# EAGLE design box_opener (EAGLE 9.3.2)
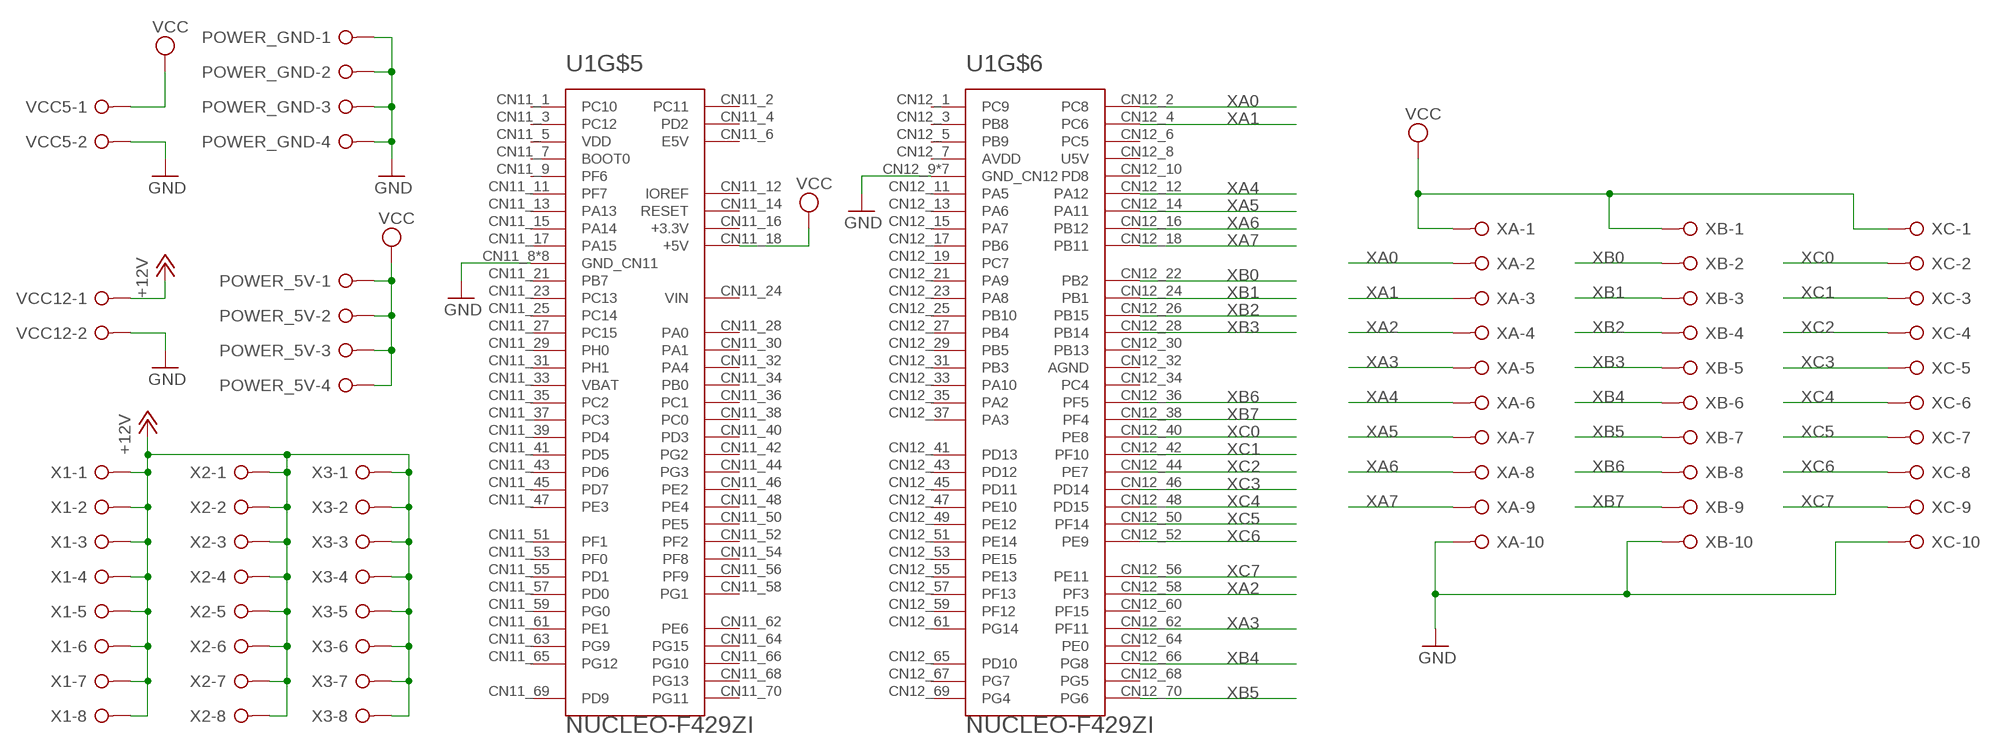
[diagram p0: schematic, sheet 1]

## Parts
POWER_5V  W237-04P  [W237-4P]
POWER_GND  W237-04P  [W237-4P]
U1  NUCLEO-F429ZI  [MODULE_NUCLEO-F429ZI]
VCC5  W237-02P  [W237-132]
VCC12  W237-02P  [W237-132]
X1  W237-08P  [W237-8P]
X2  W237-08P  [W237-8P]
X3  W237-08P  [W237-8P]
XA  W237-10P  [W237-10P]
XB  W237-10P  [W237-10P]
XC  W237-10P  [W237-10P]

## Nets
+12V: VCC12.1 X1.1 X1.2 X1.3 X1.4 X1.5 X1.6 X1.7 X1.8 X2.1 X2.2 X2.3 X2.4 X2.5 X2.6 X2.7 X2.8 X3.1 X3.2 X3.3 X3.4 X3.5 X3.6 X3.7 X3.8
GND: POWER_GND.1 POWER_GND.2 POWER_GND.3 POWER_GND.4 U1.CN11_8(GND_CN11) U1.CN11_19(GND_CN11) U1.CN11_20(GND_CN11) U1.CN11_22(GND_CN11) U1.CN11_49(GND_CN11) U1.CN11_60(GND_CN11) U1.CN11_71(GND_CN11) U1.CN11_72(GND_CN11) U1.CN12_9(GND_CN12) U1.CN12_20(GND_CN12) U1.CN12_39(GND_CN12) U1.CN12_54(GND_CN12) U1.CN12_63(GND_CN12) U1.CN12_71(GND_CN12) U1.CN12_72(GND_CN12) VCC5.2 VCC12.2 XA.10 XB.10 XC.10
VCC: POWER_5V.1 POWER_5V.2 POWER_5V.3 POWER_5V.4 U1.CN11_18(+5V) VCC5.1 XA.1 XB.1 XC.1
XA0: U1.CN12_2(PC8) XA.2
XA1: U1.CN12_4(PC6) XA.3
XA2: U1.CN12_58(PF3) XA.4
XA3: U1.CN12_62(PF11) XA.5
XA4: U1.CN12_12(PA12) XA.6
XA5: U1.CN12_14(PA11) XA.7
XA6: U1.CN12_16(PB12) XA.8
XA7: U1.CN12_18(PB11) XA.9
XB0: U1.CN12_22(PB2) XB.2
XB1: U1.CN12_24(PB1) XB.3
XB2: U1.CN12_26(PB15) XB.4
XB3: U1.CN12_28(PB14) XB.5
XB4: U1.CN12_66(PG8) XB.6
XB5: U1.CN12_70(PG6) XB.7
XB6: U1.CN12_36(PF5) XB.8
XB7: U1.CN12_38(PF4) XB.9
XC0: U1.CN12_40(PE8) XC.2
XC1: U1.CN12_42(PF10) XC.3
XC2: U1.CN12_44(PE7) XC.4
XC3: U1.CN12_46(PD14) XC.5
XC4: U1.CN12_48(PD15) XC.6
XC5: U1.CN12_50(PF14) XC.7
XC6: U1.CN12_52(PE9) XC.8
XC7: U1.CN12_56(PE11) XC.9
Unconnected: U1.CN7_1(D16/PC6/I2S_A_MCK) U1.CN7_2(D15/PB8/I2C_A_SCL) U1.CN7_3(D17/PB15/I2S_A_SD) U1.CN7_4(D14/PB9/I2C_A_SDA) U1.CN7_5(D18/PB13/I2S_A_CK) U1.CN7_6(AVDD) U1.CN7_7(D19/PB12/I2S_A_WS) U1.CN7_8(GND_CN7) U1.CN7_9(D20/PA15/I2S_B_WS) U1.CN7_10(D13/PA5/SPI_A_SCK) U1.CN7_11(D21/PC7/I2S_B_MCK) U1.CN7_12(D12/PA6/SPI_A_MISO) U1.CN7_13(D22/PB5/I2S_B_SD/SPI_B_MOSI) U1.CN7_14(D11/ETH/PA7/SPI_A_MOSI/TIM_E_PWM1) U1.CN7_15(D23/PB3/I2S_B_CK/SPI_B_SCK) U1.CN7_16(D10/PD14/SPI_A_CS/TIM_B_PWM3) U1.CN7_17(D24/PA4/SPI_B_NSS) U1.CN7_18(D9/PD15/TIMER_B_PWM2) U1.CN7_19(D25/PB4/SPI_B_MISO) U1.CN7_20(D8/PF12) U1.CN8_2(D43/PC8/SDMMC_D0) U1.CN8_3(IOREF) U1.CN8_4(D44/PC9/SDMMC_D1/I2S_A_CKIN) U1.CN8_5(RESET) U1.CN8_6(D45/PC10/SDMMC_D2) U1.CN8_7(+3.3V) U1.CN8_8(D46/PC11/SDMMC_D3) U1.CN8_9(+5V) U1.CN8_10(D47/PC12/SDMMC_CK) U1.CN8_11(GND_CN8) U1.CN8_12(D48/PD2/SDMMC_CMD) U1.CN8_13(GND_CN8) U1.CN8_14(D49/PG2) U1.CN8_15(VIN) U1.CN8_16(D50/PG3) U1.CN9_1(A0/PA3) U1.CN9_2(D51/PD7/USART_B_SCLK) U1.CN9_3(A1/PC0) U1.CN9_4(D52/PD6/USART_B_RX) U1.CN9_5(A2/PC3) U1.CN9_6(D53/PD5/USART_B_TX) U1.CN9_7(A3/PF3) U1.CN9_8(D54/PD4/USART_B_RTS) U1.CN9_9(A4/PF5) U1.CN9_10(D55/PD3/USART_B_CTS) U1.CN9_11(A5/PF10) U1.CN9_12(GND_CN9) U1.CN9_13(D72/NC) U1.CN9_14(D56/PE2/SAI_A_MCLK) U1.CN9_15(D71/PA7) U1.CN9_16(D57/PE4/SAI_A_FS) U1.CN9_17(D70/PF2/I2C_B_SMBA) U1.CN9_18(D58/PE5/SAI_A_SCK) U1.CN9_19(D69/PF1/I2C_B_SCL) U1.CN9_20(D59/PE6/SAI_A_SD) U1.CN9_21(D68/PF0/I2C_B_SDA) U1.CN9_22(D60/PE3/SAI_B_SD) U1.CN9_23(GND_CN9) U1.CN9_24(D61/PF8/SAI_B_SCK) U1.CN9_25(D67/PD0/CAN_RX) U1.CN9_26(D62/PF7/SAI_B_MCLK) U1.CN9_27(D66/PD1/CAN_TX) U1.CN9_28(D63/PF9/SAI_B_FS) U1.CN9_29(D65/PG0) U1.CN9_30(D64/PG1) U1.CN10_1(AVDD) U1.CN10_2(D7/PF13) U1.CN10_3(AGND) U1.CN10_4(D6/PE9/TIMER_A_PWM1) U1.CN10_5(GND_CN10) U1.CN10_6(D5/PE11/TIMER_A_PWM2) U1.CN10_7(A6/PB1/ADC_A_IN) U1.CN10_8(D4/PF14) U1.CN10_9(A7/PC2/ADC_B_IN) U1.CN10_10(D3/PE13/TIMER_A_PWM3) U1.CN10_11(A8/PF4/ADC_C_IN) U1.CN10_12(D2/PF15) U1.CN10_13(D26/PB6) U1.CN10_14(D1/PG14/USART_A_TX) U1.CN10_15(D27/PB2) U1.CN10_16(D0/PG9/USART_A_RX) U1.CN10_17(GND_CN10) U1.CN10_18(D42/PE8/TIMER_A_PWM1N) U1.CN10_19(D28/PD13) U1.CN10_20(D41/PE7/TIMER_A_ETR) U1.CN10_21(D29/PD12) U1.CN10_22(GND_CN10) U1.CN10_23(D30/PD11) U1.CN10_24(D40/PE10/TIMER_A_PWM2N) U1.CN10_25(D31/PE2) U1.CN10_26(D39/PE12/TIMER_A_PWM3N) U1.CN10_27(GND_CN10) U1.CN10_28(D38/PE14) U1.CN10_29(D32/PA0/TIMER_C_PWM1) U1.CN10_30(D37/PE15/TIMER_A_BKIN1) U1.CN10_31(D33/PB0/TIMER_D_PWM1) U1.CN10_32(D36/PB10/TIMER_C_PWM2) U1.CN10_33(D34/PE0/TIMER_B_ETR) U1.CN10_34(D35/PB11/TIMER_C_PWM3) U1.CN11_1(PC10) U1.CN11_2(PC11) U1.CN11_3(PC12) U1.CN11_4(PD2) U1.CN11_5(VDD) U1.CN11_6(E5V) U1.CN11_7(BOOT0) U1.CN11_9(PF6) U1.CN11_11(PF7) U1.CN11_12(IOREF) U1.CN11_13(PA13) U1.CN11_14(RESET) U1.CN11_15(PA14) U1.CN11_16(+3.3V) U1.CN11_17(PA15) U1.CN11_21(PB7) U1.CN11_23(PC13) U1.CN11_24(VIN) U1.CN11_25(PC14) U1.CN11_27(PC15) U1.CN11_28(PA0) U1.CN11_29(PH0) U1.CN11_30(PA1) U1.CN11_31(PH1) U1.CN11_32(PA4) U1.CN11_33(VBAT) U1.CN11_34(PB0) U1.CN11_35(PC2) U1.CN11_36(PC1) U1.CN11_37(PC3) U1.CN11_38(PC0) U1.CN11_39(PD4) U1.CN11_40(PD3) U1.CN11_41(PD5) U1.CN11_42(PG2) U1.CN11_43(PD6) U1.CN11_44(PG3) U1.CN11_45(PD7) U1.CN11_46(PE2) U1.CN11_47(PE3) U1.CN11_48(PE4) U1.CN11_50(PE5) U1.CN11_51(PF1) U1.CN11_52(PF2) U1.CN11_53(PF0) U1.CN11_54(PF8) U1.CN11_55(PD1) U1.CN11_56(PF9) U1.CN11_57(PD0) U1.CN11_58(PG1) U1.CN11_59(PG0) U1.CN11_61(PE1) U1.CN11_62(PE6) U1.CN11_63(PG9) U1.CN11_64(PG15) U1.CN11_65(PG12) U1.CN11_66(PG10) U1.CN11_68(PG13) U1.CN11_69(PD9) U1.CN11_70(PG11) U1.CN12_1(PC9) U1.CN12_3(PB8) U1.CN12_5(PB9) U1.CN12_6(PC5) U1.CN12_7(AVDD) U1.CN12_8(U5V) U1.CN12_10(PD8) U1.CN12_11(PA5) U1.CN12_13(PA6) U1.CN12_15(PA7) U1.CN12_17(PB6) U1.CN12_19(PC7) U1.CN12_21(PA9) U1.CN12_23(PA8) U1.CN12_25(PB10) U1.CN12_27(PB4) U1.CN12_29(PB5) U1.CN12_30(PB13) U1.CN12_31(PB3) U1.CN12_32(AGND) U1.CN12_33(PA10) U1.CN12_34(PC4) U1.CN12_35(PA2) U1.CN12_37(PA3) U1.CN12_41(PD13) U1.CN12_43(PD12) U1.CN12_45(PD11) U1.CN12_47(PE10) U1.CN12_49(PE12) U1.CN12_51(PE14) U1.CN12_53(PE15) U1.CN12_55(PE13) U1.CN12_57(PF13) U1.CN12_59(PF12) U1.CN12_60(PF15) U1.CN12_61(PG14) U1.CN12_64(PE0) U1.CN12_65(PD10) U1.CN12_67(PG7) U1.CN12_68(PG5) U1.CN12_69(PG4)

## Library data of the parts
POWER_5V POWER_GND = con-wago-508:W237-04P: WAGO SREW CLAMP; OC_FARNELL: unknown; OC_NEWARK: unknown
U1 = NUCLEO-F429ZI:NUCLEO-F429ZI: STM32 Nucleo-144 development board with STM32F429ZIT6 MCU, supports Arduino, ST Zio and Morpho; AVAILABILITY: Unavailable; DESCRIPTION: STM32 Nucleo-144 development board with STM32F429ZIT6 MCU, supports Arduino, ST Zio and Morpho; MF: STMicroelectronics; MP: NUCLEO-F429ZI; PACKAGE: None; PRICE: None
VCC5 VCC12 = con-wago-508:W237-02P: WAGO SREW CLAMP; OC_FARNELL: unknown; OC_NEWARK: unknown
X1-X3 = con-wago-508:W237-08P: WAGO SREW CLAMP; OC_FARNELL: unknown; OC_NEWARK: unknown
XA XB XC = con-wago-508:W237-10P: WAGO SREW CLAMP; OC_FARNELL: unknown; OC_NEWARK: unknown

## Board
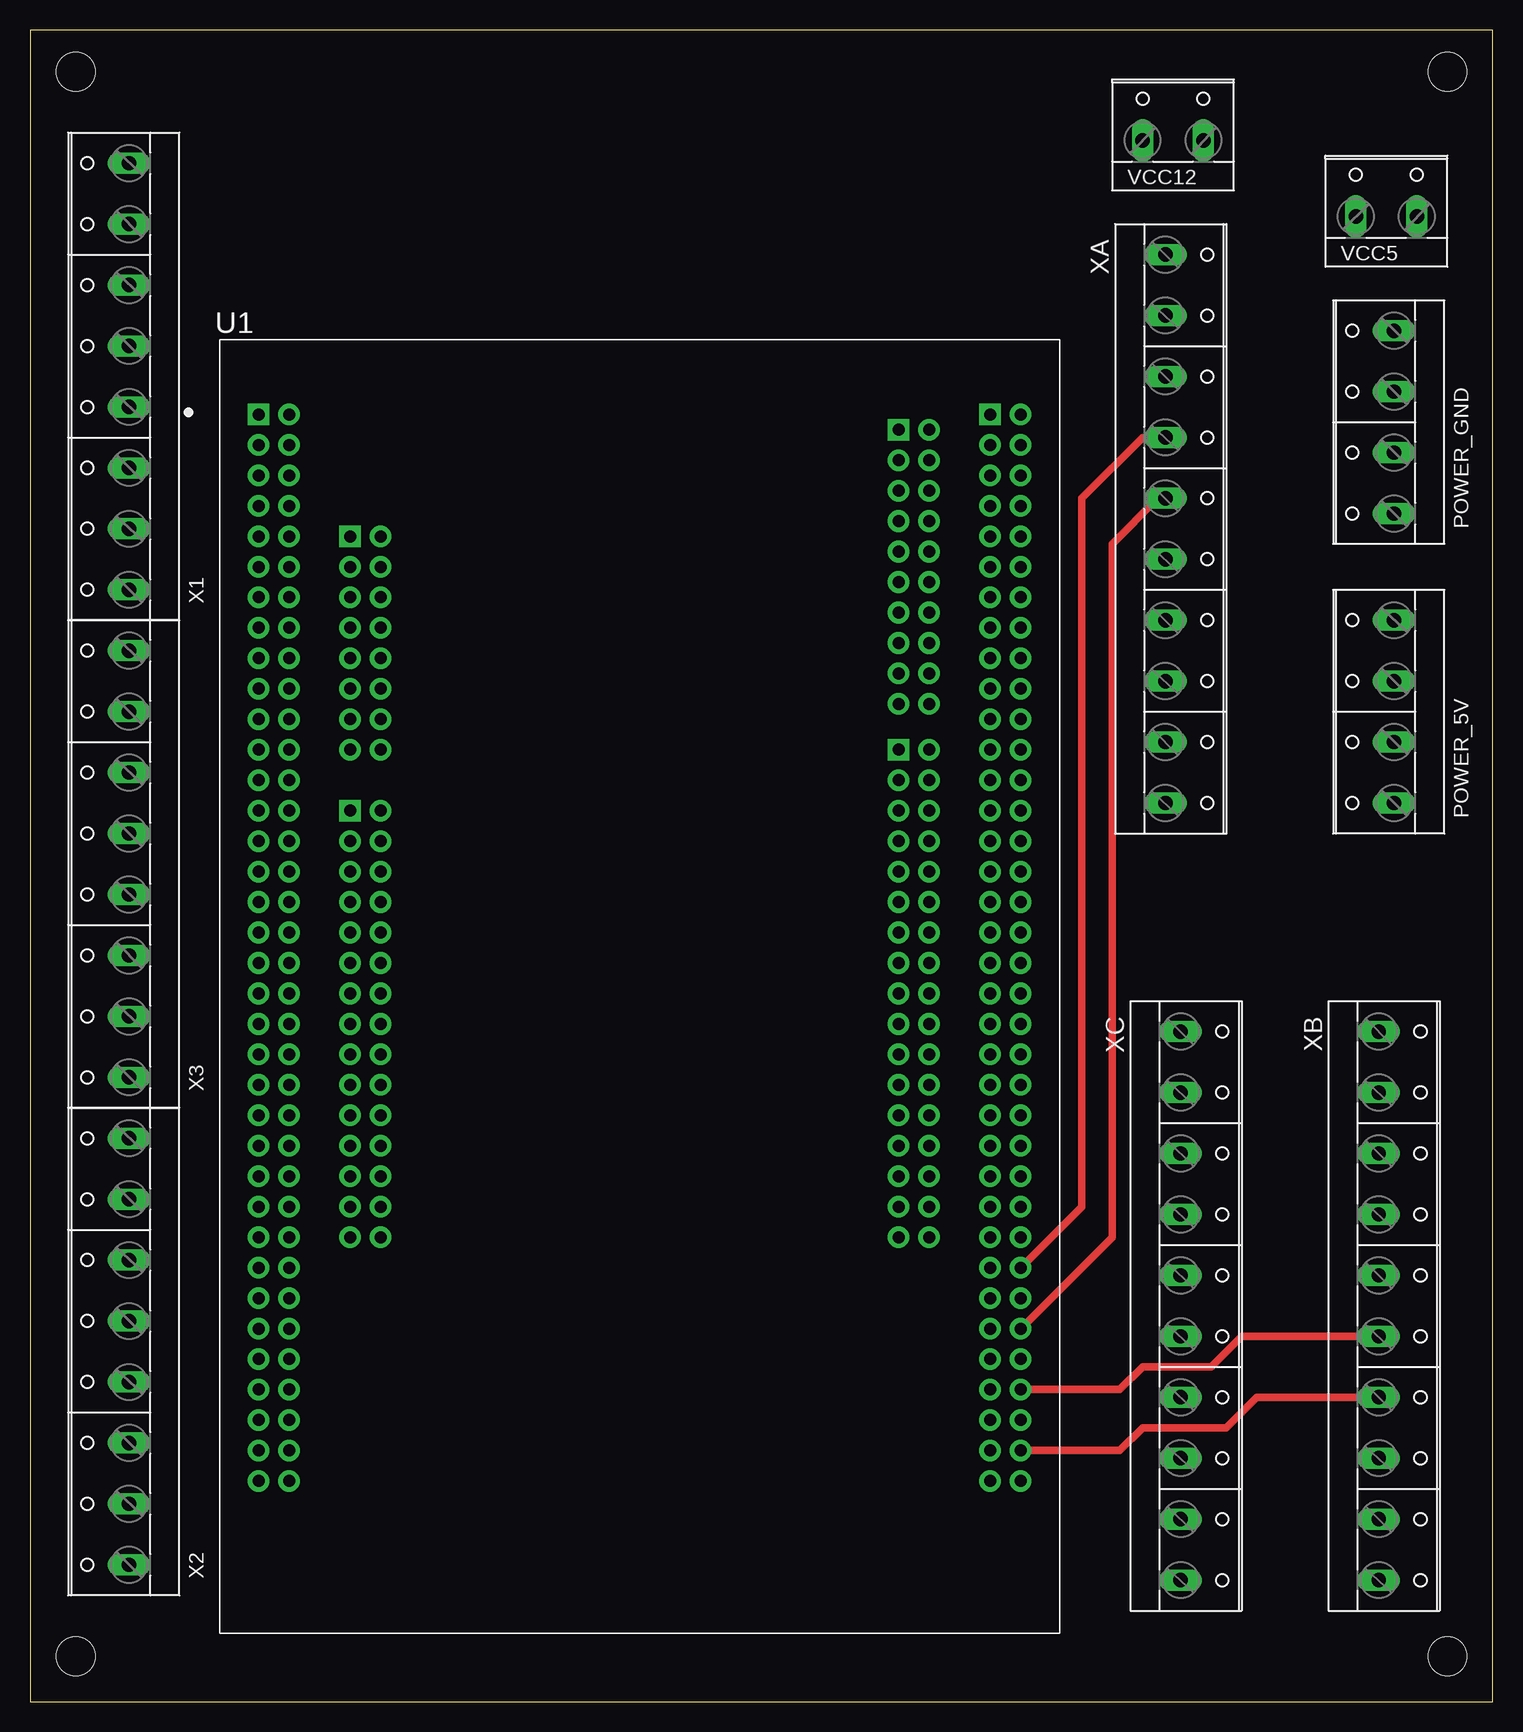
[diagram p1: board, top side]
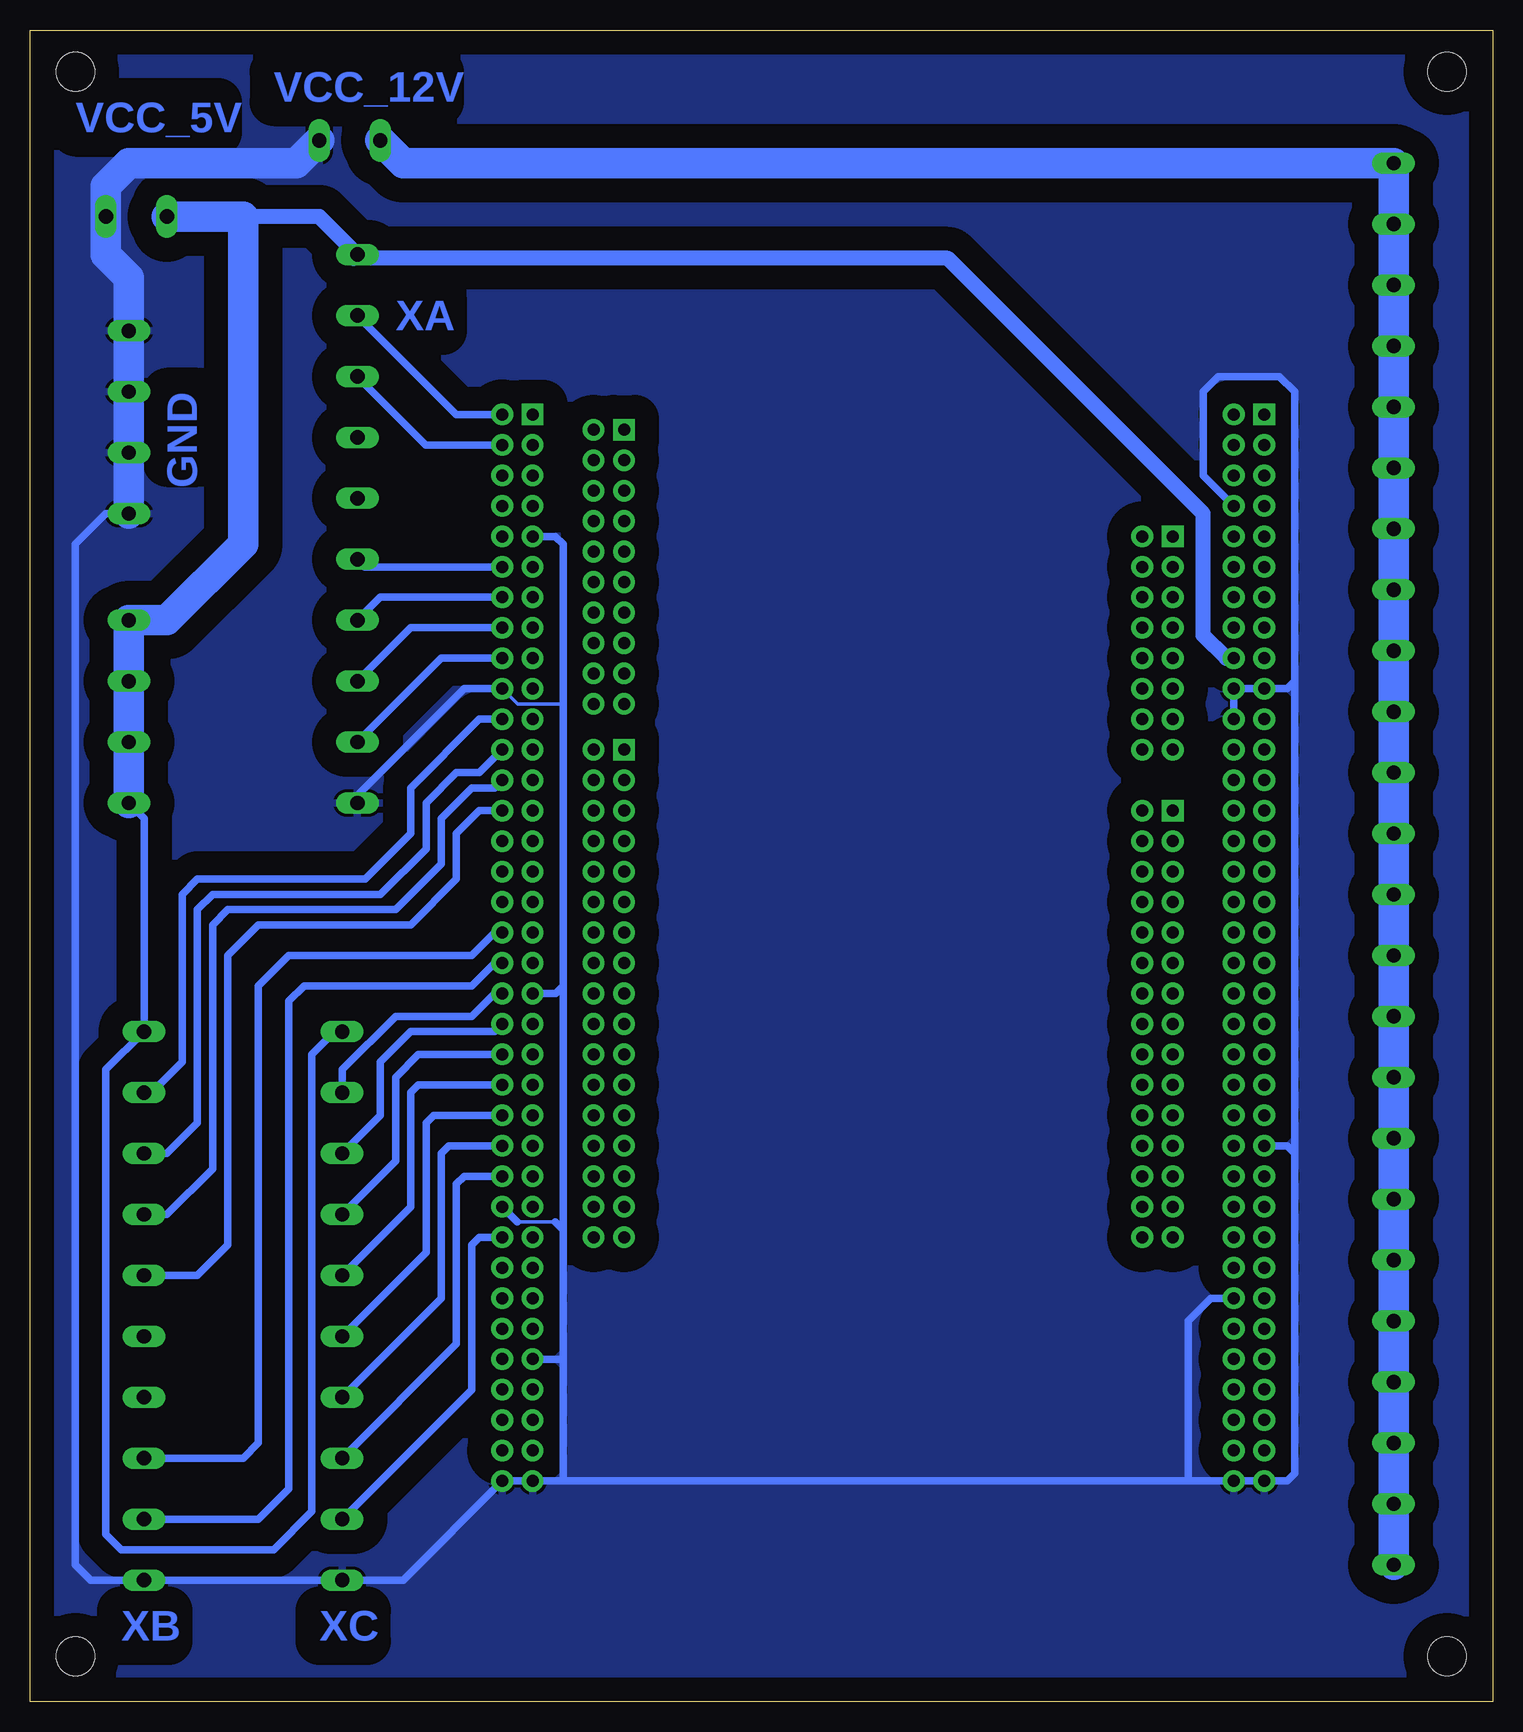
[diagram p2: board, bottom side, seen from below]

Size 121.9 x 139.37 mm. Coordinates in mm from the lower left corner, seen from the top.
Outline: 0,0 121.9,0 121.9,139.37 0,139.37 0,0
Copper layers (1*16): Top 0.035mm / dielectric 1.5mm / Bottom 0.035mm
Design rules "default": minimum track width 6mil, minimum drill 0.35mm, track to track 6mil, track to pad 6mil, pad to pad 6mil, via to via 6mil, smd to smd 6mil, copper to edge 40mil, drill to drill 6mil, minimum pad ring 10mil, minimum via ring 8mil, stop-mask expansion 4mil, vias tented up to drill 0mil, thermal gap 10mil
Holes 3.2 mm at 3.81,3.81 118.11,3.81 118.11,135.89 3.81,135.89

### Footprints (pad centres in the part's own frame; a part is rotated, then mirrored left to right if it is on the bottom)
W237-4P = drill 1.194 long: 1 -7.62,-0.635; 2 -2.54,-0.635; 3 2.54,-0.635; 4 7.62,-0.635
MODULE_NUCLEO-F429ZI = drill 1 pad 1.8 square: CN7_1 21.59,43.82; CN8_1 -24.13,34.93; CN9_1 -24.13,12.07; CN10_1 21.59,17.15; CN11_1 -31.75,45.09; CN12_1 29.21,45.09 | drill 1 pad 1.8: CN7_2 24.13,43.82; CN7_3 21.59,41.28; CN7_4 24.13,41.28; CN7_5 21.59,38.74; CN7_6 24.13,38.74; CN7_7 21.59,36.2; CN7_8 24.13,36.2; CN7_9 21.59,33.66; CN7_10 24.13,33.66; CN7_11 21.59,31.12; CN7_12 24.13,31.12; CN7_13 21.59,28.58; CN7_14 24.13,28.58; CN7_15 21.59,26.04; CN7_16 24.13,26.04; CN7_17 21.59,23.5; CN7_18 24.13,23.5; CN7_19 21.59,20.96; CN7_20 24.13,20.96; CN8_2 -21.59,34.93; CN8_3 -24.13,32.39; CN8_4 -21.59,32.39; CN8_5 -24.13,29.85; CN8_6 -21.59,29.85; CN8_7 -24.13,27.31; CN8_8 -21.59,27.31; CN8_9 -24.13,24.77; CN8_10 -21.59,24.77; CN8_11 -24.13,22.23; CN8_12 -21.59,22.23; CN8_13 -24.13,19.69; CN8_14 -21.59,19.69; CN8_15 -24.13,17.15; CN8_16 -21.59,17.15; CN9_2 -21.59,12.07; CN9_3 -24.13,9.53; CN9_4 -21.59,9.53; CN9_5 -24.13,6.99; CN9_6 -21.59,6.99; CN9_7 -24.13,4.45; CN9_8 -21.59,4.45; CN9_9 -24.13,1.91; CN9_10 -21.59,1.91; CN9_11 -24.13,-0.63; CN9_12 -21.59,-0.63; CN9_13 -24.13,-3.17; CN9_14 -21.59,-3.17; CN9_15 -24.13,-5.71; CN9_16 -21.59,-5.71; CN9_17 -24.13,-8.25; CN9_18 -21.59,-8.25; CN9_19 -24.13,-10.79; CN9_20 -21.59,-10.79; CN9_21 -24.13,-13.33; CN9_22 -21.59,-13.33; CN9_23 -24.13,-15.87; CN9_24 -21.59,-15.87; CN9_25 -24.13,-18.41; CN9_26 -21.59,-18.41; CN9_27 -24.13,-20.95; CN9_28 -21.59,-20.95; CN9_29 -24.13,-23.49; CN9_30 -21.59,-23.49; CN10_2 24.13,17.15; CN10_3 21.59,14.61; CN10_4 24.13,14.61; CN10_5 21.59,12.07; CN10_6 24.13,12.07; CN10_7 21.59,9.53; CN10_8 24.13,9.53; CN10_9 21.59,6.99; CN10_10 24.13,6.99; CN10_11 21.59,4.45; CN10_12 24.13,4.45; CN10_13 21.59,1.91; CN10_14 24.13,1.91; CN10_15 21.59,-0.63; CN10_16 24.13,-0.63; CN10_17 21.59,-3.17; CN10_18 24.13,-3.17; CN10_19 21.59,-5.71; CN10_20 24.13,-5.71; CN10_21 21.59,-8.25; CN10_22 24.13,-8.25; CN10_23 21.59,-10.79; CN10_24 24.13,-10.79; CN10_25 21.59,-13.33; CN10_26 24.13,-13.33; CN10_27 21.59,-15.87; CN10_28 24.13,-15.87; CN10_29 21.59,-18.41; CN10_30 24.13,-18.41; CN10_31 21.59,-20.95; CN10_32 24.13,-20.95; CN10_33 21.59,-23.49; CN10_34 24.13,-23.49; CN11_2 -29.21,45.09; CN11_3 -31.75,42.55; CN11_4 -29.21,42.55; CN11_5 -31.75,40.01; CN11_6 -29.21,40.01; CN11_7 -31.75,37.47; CN11_8 -29.21,37.47; CN11_9 -31.75,34.93; CN11_10 -29.21,34.93; CN11_11 -31.75,32.39; CN11_12 -29.21,32.39; CN11_13 -31.75,29.85; CN11_14 -29.21,29.85; CN11_15 -31.75,27.31; CN11_16 -29.21,27.31; CN11_17 -31.75,24.77; CN11_18 -29.21,24.77; CN11_19 -31.75,22.23; CN11_20 -29.21,22.23; CN11_21 -31.75,19.69; CN11_22 -29.21,19.69; CN11_23 -31.75,17.15; CN11_24 -29.21,17.15; CN11_25 -31.75,14.61; CN11_26 -29.21,14.61; CN11_27 -31.75,12.07; CN11_28 -29.21,12.07; CN11_29 -31.75,9.53; CN11_30 -29.21,9.53; CN11_31 -31.75,6.99; CN11_32 -29.21,6.99; CN11_33 -31.75,4.45; CN11_34 -29.21,4.45; CN11_35 -31.75,1.91; CN11_36 -29.21,1.91; CN11_37 -31.75,-0.63; CN11_38 -29.21,-0.63; CN11_39 -31.75,-3.17; CN11_40 -29.21,-3.17; CN11_41 -31.75,-5.71; CN11_42 -29.21,-5.71; CN11_43 -31.75,-8.25; CN11_44 -29.21,-8.25; CN11_45 -31.75,-10.79; CN11_46 -29.21,-10.79; CN11_47 -31.75,-13.33; CN11_48 -29.21,-13.33; CN11_49 -31.75,-15.87; CN11_50 -29.21,-15.87; CN11_51 -31.75,-18.41; CN11_52 -29.21,-18.41; CN11_53 -31.75,-20.95; CN11_54 -29.21,-20.95; CN11_55 -31.75,-23.49; CN11_56 -29.21,-23.49; CN11_57 -31.75,-26.03; CN11_58 -29.21,-26.03; CN11_59 -31.75,-28.57; CN11_60 -29.21,-28.57; CN11_61 -31.75,-31.11; CN11_62 -29.21,-31.11; CN11_63 -31.75,-33.65; CN11_64 -29.21,-33.65; CN11_65 -31.75,-36.19; CN11_66 -29.21,-36.19; CN11_67 -31.75,-38.73; CN11_68 -29.21,-38.73; CN11_69 -31.75,-41.27; CN11_70 -29.21,-41.27; CN11_71 -31.75,-43.81; CN11_72 -29.21,-43.81; CN12_2 31.75,45.09; CN12_3 29.21,42.55; CN12_4 31.75,42.55; CN12_5 29.21,40.01; CN12_6 31.75,40.01; CN12_7 29.21,37.47; CN12_8 31.75,37.47; CN12_9 29.21,34.93; CN12_10 31.75,34.93; CN12_11 29.21,32.39; CN12_12 31.75,32.39; CN12_13 29.21,29.85; CN12_14 31.75,29.85; CN12_15 29.21,27.31; CN12_16 31.75,27.31; CN12_17 29.21,24.77; CN12_18 31.75,24.77; CN12_19 29.21,22.23; CN12_20 31.75,22.23; CN12_21 29.21,19.69; CN12_22 31.75,19.69; CN12_23 29.21,17.15; CN12_24 31.75,17.15; CN12_25 29.21,14.61; CN12_26 31.75,14.61; CN12_27 29.21,12.07; CN12_28 31.75,12.07; CN12_29 29.21,9.53; CN12_30 31.75,9.53; CN12_31 29.21,6.99; CN12_32 31.75,6.99; CN12_33 29.21,4.45; CN12_34 31.75,4.45; CN12_35 29.21,1.91; CN12_36 31.75,1.91; CN12_37 29.21,-0.63; CN12_38 31.75,-0.63; CN12_39 29.21,-3.17; CN12_40 31.75,-3.17; CN12_41 29.21,-5.71; CN12_42 31.75,-5.71; CN12_43 29.21,-8.25; CN12_44 31.75,-8.25; CN12_45 29.21,-10.79; CN12_46 31.75,-10.79; CN12_47 29.21,-13.33; CN12_48 31.75,-13.33; CN12_49 29.21,-15.87; CN12_50 31.75,-15.87; CN12_51 29.21,-18.41; CN12_52 31.75,-18.41; CN12_53 29.21,-20.95; CN12_54 31.75,-20.95; CN12_55 29.21,-23.49; CN12_56 31.75,-23.49; CN12_57 29.21,-26.03; CN12_58 31.75,-26.03; CN12_59 29.21,-28.57; CN12_60 31.75,-28.57; CN12_61 29.21,-31.11; CN12_62 31.75,-31.11; CN12_63 29.21,-33.65; CN12_64 31.75,-33.65; CN12_65 29.21,-36.19; CN12_66 31.75,-36.19; CN12_67 29.21,-38.73; CN12_68 31.75,-38.73; CN12_69 29.21,-41.27; CN12_70 31.75,-41.27; CN12_71 29.21,-43.81; CN12_72 31.75,-43.81
W237-132 = drill 1.194 long: 1 -2.54,-0.635; 2 2.54,-0.635
W237-8P = drill 1.194 long: 1 -17.78,-0.635; 2 -12.7,-0.635; 3 -7.62,-0.635; 4 -2.54,-0.635; 5 2.54,-0.635; 6 7.62,-0.635; 7 12.7,-0.635; 8 17.78,-0.635
W237-10P = drill 1.194 long: 1 -22.86,-0.635; 2 -17.78,-0.635; 3 -12.7,-0.635; 4 -7.62,-0.635; 5 -2.54,-0.635; 6 2.54,-0.635; 7 7.62,-0.635; 8 12.7,-0.635; 9 17.78,-0.635; 10 22.86,-0.635

### Placement (x,y rotation side)
POWER_5V  113.03,82.55 90 top
POWER_GND  113.03,106.68 90 top
U1  50.8,62.23 0 top
VCC5  113.03,124.46 0 top
VCC12  95.25,130.81 0 top
X1  7.62,110.49 90 top
X2  7.62,29.21 90 top
X3  7.62,69.85 90 top
XA  95.25,97.79 270 top
XB  113.03,33.02 270 top
XC  96.52,33.02 270 top

### Tracks (layer width: path | path; a pad name or v marks a point on that pad's centre or on a via)
+12V
  Bottom 2.54: X2.1 X2.2 X2.3 X2.4 X2.5 X2.6 X2.7 X2.8 X3.1 X3.2 X3.3 X3.4 X3.5 X3.6 X3.7 X3.8 X1.1 X1.2 X1.3 X1.4 X1.5 X1.6 X1.7 X1.8 90.81,128.27 VCC12.1
GND
  Bottom 0.305: 78.11,40.01 81.28,40.01 | U1.CN12_20 81.28,83.19 77.47,83.19
  Bottom 0.61: U1.CN12_20 85.72,84.46 94.61,75.56 XA.10 | 25.4,18.42 U1.CN11_72 U1.CN11_71 17.14,18.42 16.51,19.05 16.51,45.72 | 25.4,18.42 77.47,18.42 | 77.47,18.42 U1.CN12_71 U1.CN12_72 90.81,10.16 XC.10 XB.10 116.84,10.16 118.11,11.43 118.11,96.52 115.57,99.06 POWER_GND.1 | U1.CN12_54 81.28,40.01 | 77.47,18.42 77.47,28.57 | 77.47,28.57 77.47,39.37 | 77.47,39.37 78.11,40.01 | 25.4,18.42 25.4,31.75 23.49,33.66 U1.CN11_60 | U1.CN11_49 17.15,46.36 16.51,45.72 | U1.CN11_22 U1.CN11_20 U1.CN11_19 17.14,84.46 16.51,85.09 | U1.CN11_8 24.13,102.24 24.13,109.22 22.86,110.49 17.78,110.49 16.51,109.22 16.51,85.09 | 16.51,85.09 16.51,45.72 | 77.47,39.37 77.47,59.69 | 77.47,59.69 77.47,83.19 77.47,96.52 78.11,97.16 U1.CN12_9 | U1.CN12_39 78.1,59.06 77.47,59.69 | U1.CN12_63 77.47,28.57
  Bottom 2.54: POWER_GND.1 POWER_GND.2 POWER_GND.3 POWER_GND.4 113.67,118.75 115.57,120.65 VCC5.2 115.57,126.36 113.67,128.27 99.69,128.27 VCC12.2
  pour Bottom (isolate 2): 0,139.7 121.92,139.7 121.92,0 0,0
VCC
  Bottom 0.61: XC.1 96.52,55.88 98.42,53.98 98.42,15.88 101.6,12.7 114.3,12.7 115.57,13.97 115.57,52.7 XB.1 112.39,73.66 POWER_5V.1 | XA.1 94.93,120.33 | U1.CN11_18 22.23,87
  Bottom 1.27: 22.23,87 24.13,88.9 24.13,99.06 45.4,120.33 94.93,120.33 | XA.1 97.79,123.83 104.14,123.83
  Bottom 2.54: POWER_5V.1 POWER_5V.2 POWER_5V.3 POWER_5V.4 110.49,90.17 104.14,96.52 104.14,123.83 VCC5.1
XA0
  Bottom 0.61: U1.CN12_2 86.36,107.32 86.99,107.95 87,107.95 XA.2
XA1
  Bottom 0.61: XA.3 88.91,104.78 U1.CN12_4
XA2
  Top 0.61: U1.CN12_58 87.63,41.28 87.63,100.33 92.71,105.41 XA.4
XA3
  Top 0.61: U1.CN12_62 90.17,38.74 90.17,96.52 93.98,100.33 XA.5
XA4
  Bottom 0.61: XA.6 93.98,94.62 U1.CN12_12
XA5
  Bottom 0.61: U1.CN12_14 92.7,92.08 XA.7
XA6
  Bottom 0.61: U1.CN12_16 90.17,89.54 XA.8
XA7
  Bottom 0.61: U1.CN12_18 87.62,87 XA.9
XB0
  Bottom 0.61: XB.2 111.76,50.8 109.22,53.34 109.22,67.31 107.95,68.58 93.98,68.58 90.17,72.39 90.17,76.2 84.45,81.92 U1.CN12_22
XB1
  Bottom 0.61: U1.CN12_24 84.46,77.47 86.36,77.47 88.9,74.93 88.9,71.12 92.71,67.31 106.68,67.31 107.95,66.04 107.95,48.26 110.49,45.72 XB.3
XB2
  Bottom 0.61: XB.4 110.49,40.64 106.68,44.45 106.68,64.77 105.41,66.04 91.44,66.04 87.63,69.85 87.63,73.66 85.09,76.2 83.19,76.2 U1.CN12_26
XB3
  Bottom 0.61: XB.5 107.95,35.56 105.41,38.1 105.41,62.23 102.87,64.77 90.17,64.77 86.36,68.58 86.36,72.39 84.45,74.3 U1.CN12_28
XB4
  Top 0.61: U1.CN12_66 90.81,26.04 92.71,27.94 98.42,27.94 100.97,30.48 XB.6
XB5
  Top 0.61: U1.CN12_70 90.81,20.96 92.71,22.86 99.69,22.86 102.23,25.4 XB.7
XB6
  Bottom 0.61: XB.8 104.14,20.32 102.87,21.59 102.87,59.69 100.33,62.23 85.09,62.23 83.18,64.14 U1.CN12_36
XB7
  Bottom 0.61: U1.CN12_38 83.18,61.6 85.09,59.69 99.06,59.69 100.33,58.42 100.33,17.78 102.87,15.24 XB.9
XC0
  Bottom 0.61: U1.CN12_40 83.18,59.06 85.09,57.15 91.44,57.15 95.89,52.7 XC.2
XC1
  Bottom 0.61: XC.3 92.71,48.9 92.71,53.34 90.17,55.88 83.19,55.88 U1.CN12_42
XC2
  Bottom 0.61: XC.4 91.44,45.09 91.44,52.07 89.53,53.98 U1.CN12_44
XC3
  Bottom 0.61: XC.5 90.17,41.27 90.17,50.8 89.53,51.44 U1.CN12_46
XC4
  Bottom 0.61: XC.6 88.9,37.47 88.9,48.26 88.26,48.9 U1.CN12_48
XC5
  Bottom 0.61: XC.7 87.63,33.66 87.63,45.72 86.99,46.36 U1.CN12_50
XC6
  Bottom 0.61: XC.8 86.36,29.84 86.36,43.18 85.72,43.82 U1.CN12_52
XC7
  Bottom 0.61: XC.9 85.09,26.04 85.09,38.1 84.45,38.74 U1.CN12_56

### Text on the board
Bottom: VCC_12V | VCC_5V | XA | GND | XC | XB